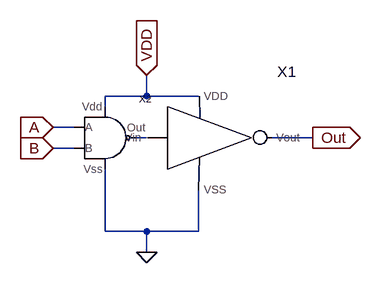
[diagram p0: schematic AND_T.asc]
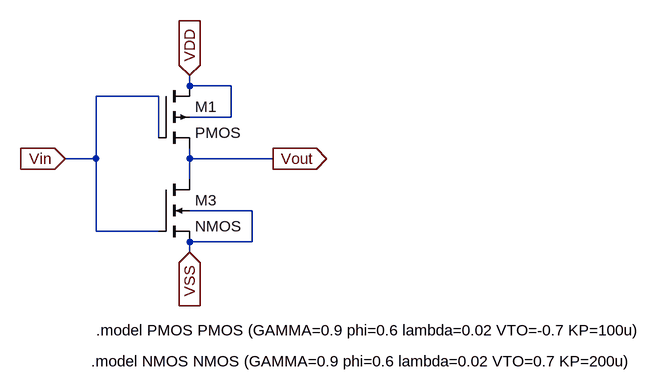
[diagram p1: sub-circuit inverter.asc]
AND_T.asc, the LTspice schematic file:
Version 4
SHEET 1 880 680
WIRE 160 96 160 64
WIRE 160 96 96 96
WIRE 240 96 160 96
WIRE 96 112 96 96
WIRE 48 144 16 144
WIRE 160 160 144 160
WIRE 416 160 352 160
WIRE 48 176 16 176
WIRE 96 304 96 208
WIRE 160 304 96 304
WIRE 240 304 240 240
WIRE 240 304 160 304
WIRE 160 336 160 304
FLAG 416 160 Out
IOPIN 416 160 Out
FLAG 16 144 A
IOPIN 16 144 In
FLAG 16 176 B
IOPIN 16 176 In
FLAG 160 64 VDD
IOPIN 160 64 In
FLAG 160 336 0
SYMBOL NAND 64 160 R0
SYMATTR InstName X2
SYMBOL INVERTER 192 160 R0
SYMATTR InstName X1

inverter.asc, the sub-circuit schematic file:
Version 4
SHEET 1 984 680
WIRE 112 32 112 16
WIRE 176 32 112 32
WIRE 64 48 -32 48
WIRE 176 80 176 32
WIRE 176 80 112 80
WIRE 64 112 64 48
WIRE -32 144 -32 48
WIRE -32 144 -80 144
WIRE 112 144 112 128
WIRE 240 144 112 144
WIRE 112 176 112 144
WIRE 208 224 112 224
WIRE -32 256 -32 144
WIRE 64 256 -32 256
WIRE 208 272 208 224
WIRE 208 272 112 272
WIRE 112 288 112 272
FLAG -80 144 Vin
IOPIN -80 144 In
FLAG 240 144 Vout
IOPIN 240 144 Out
FLAG 112 16 VDD
IOPIN 112 16 In
FLAG 112 288 VSS
IOPIN 112 288 In
SYMBOL pmos4 64 32 R0
SYMATTR InstName M1
SYMATTR Value2 l=1u w=50u
SYMBOL nmos4 64 176 R0
SYMATTR InstName M3
SYMATTR Value2 l=1u w=100u
TEXT -32 408 Left 2 !.model PMOS PMOS (GAMMA=0.9 phi=0.6 lambda=0.02 VTO=-0.7 KP=100u)
TEXT -40 456 Left 2 !.model NMOS NMOS (GAMMA=0.9 phi=0.6 lambda=0.02 VTO=0.7 KP=200u)

The netlist it stands for:
* AND_T.asc
XX2 A B N001 0 VDD NAND  ; pins A B Out Vss Vdd
XX1 VDD N001 0 Out inverter

* block symbol definitions
.subckt inverter VDD Vin VSS Vout
M1 VDD Vin Vout VDD PMOS l=1u w=50u
M3 Vout Vin VSS VSS NMOS l=1u w=100u
.model PMOS PMOS (GAMMA=0.9 phi=0.6 lambda=0.02 VTO=-0.7 KP=100u)
.model NMOS NMOS (GAMMA=0.9 phi=0.6 lambda=0.02 VTO=0.7 KP=200u)
.ends inverter

.model NMOS NMOS
.model PMOS PMOS
.lib standard.mos
.backanno
.end